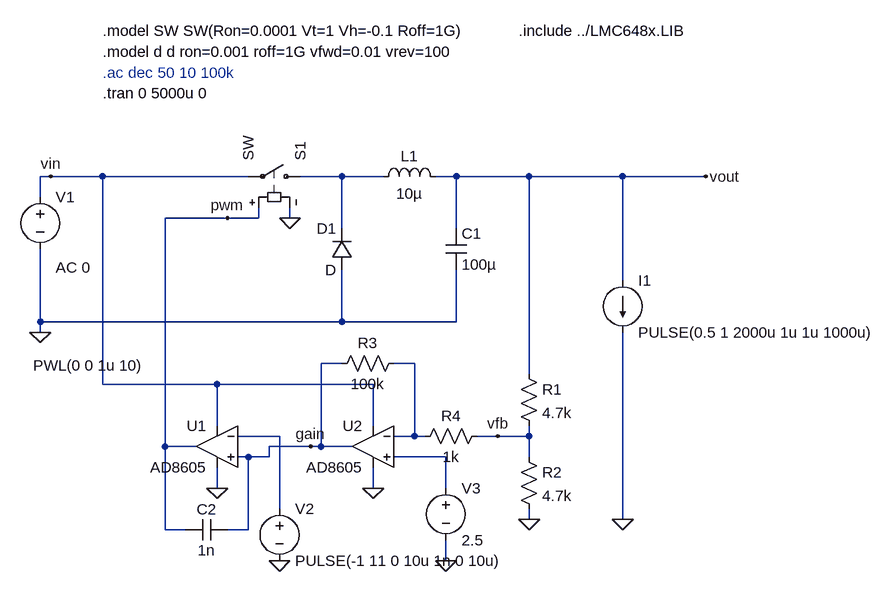
[diagram p0: schematic avg-ac-fb.asc]
avg-ac-fb.asc, the LTspice schematic file:
Version 4
SHEET 1 1492 740
WIRE -128 112 -144 112
WIRE -48 112 -128 112
WIRE 176 112 -48 112
WIRE 320 112 256 112
WIRE 384 112 320 112
WIRE 496 112 464 112
WIRE 608 112 496 112
WIRE 752 112 608 112
WIRE 880 112 752 112
WIRE -144 144 -144 112
WIRE 144 176 48 176
WIRE 192 176 192 160
WIRE 192 176 144 176
WIRE 240 176 240 160
WIRE 320 192 320 112
WIRE 496 192 496 112
WIRE 752 272 752 112
WIRE -144 336 -144 224
WIRE 320 336 320 256
WIRE 320 336 -144 336
WIRE 496 336 496 256
WIRE 496 336 320 336
WIRE -144 352 -144 336
WIRE 320 400 288 400
WIRE 432 400 400 400
WIRE 608 416 608 112
WIRE -48 432 -48 112
WIRE 128 432 -48 432
WIRE 368 432 128 432
WIRE 128 496 128 432
WIRE 368 496 368 432
WIRE 224 512 160 512
WIRE 432 512 432 400
WIRE 432 512 400 512
WIRE 448 512 432 512
WIRE 560 512 528 512
WIRE 608 512 608 496
WIRE 608 512 560 512
WIRE 48 528 48 176
WIRE 96 528 48 528
WIRE 272 528 208 528
WIRE 288 528 288 400
WIRE 288 528 272 528
WIRE 336 528 288 528
WIRE 176 544 160 544
WIRE 208 544 208 528
WIRE 208 544 176 544
WIRE 480 544 400 544
WIRE 608 544 608 512
WIRE 128 592 128 560
WIRE 368 592 368 560
WIRE 480 592 480 544
WIRE 224 624 224 512
WIRE 608 640 608 624
WIRE 752 640 752 352
WIRE 48 656 48 528
WIRE 80 656 48 656
WIRE 176 656 176 544
WIRE 176 656 144 656
WIRE 480 704 480 672
FLAG -144 352 0
FLAG 880 112 vout
FLAG -128 112 vin
FLAG 144 176 pwm
FLAG 608 640 0
FLAG 480 704 0
FLAG 368 592 0
FLAG 752 640 0
FLAG 128 592 0
FLAG 240 176 0
FLAG 224 704 0
FLAG 560 512 vfb
FLAG 272 528 gain
SYMBOL voltage -144 128 R0
WINDOW 123 24 124 Left 2
WINDOW 39 0 0 Left 0
WINDOW 3 -11 275 Left 2
SYMATTR Value2 AC 0
SYMATTR Value PWL(0 0 1u 10)
SYMATTR InstName V1
SYMBOL ind 368 128 R270
WINDOW 0 32 56 VTop 2
WINDOW 3 5 56 VBottom 2
SYMATTR InstName L1
SYMATTR Value 10µ
SYMBOL cap 480 192 R0
SYMATTR InstName C1
SYMATTR Value 100µ
SYMBOL res 592 400 R0
SYMATTR InstName R1
SYMATTR Value 4.7k
SYMBOL res 592 528 R0
SYMATTR InstName R2
SYMATTR Value 4.7k
SYMBOL voltage 480 576 R0
WINDOW 123 0 0 Left 0
WINDOW 39 0 0 Left 0
SYMATTR InstName V3
SYMATTR Value 2.5
SYMBOL current 752 272 R0
WINDOW 123 0 0 Left 0
WINDOW 39 0 0 Left 0
SYMATTR InstName I1
SYMATTR Value PULSE(0.5 1 2000u 1u 1u 1000u)
SYMBOL diode 336 256 R180
WINDOW 0 24 64 Left 2
WINDOW 3 24 0 Left 2
SYMATTR InstName D1
SYMBOL sw 272 112 M270
SYMATTR InstName S1
SYMBOL voltage 224 608 R0
WINDOW 123 0 0 Left 0
WINDOW 39 0 0 Left 0
SYMATTR InstName V2
SYMATTR Value PULSE(-1 11 0 10u 1n 0 10u)
SYMBOL OpAmps\\AD8605 128 464 M0
SYMATTR InstName U1
SYMBOL OpAmps\\AD8605 368 464 M0
SYMATTR InstName U2
SYMBOL res 416 384 R90
WINDOW 0 0 56 VBottom 2
WINDOW 3 32 56 VTop 2
SYMATTR InstName R3
SYMATTR Value 100k
SYMBOL res 544 496 R90
WINDOW 0 0 56 VBottom 2
WINDOW 3 32 56 VTop 2
SYMATTR InstName R4
SYMATTR Value 1k
SYMBOL cap 144 640 R90
WINDOW 0 0 32 VBottom 2
WINDOW 3 32 32 VTop 2
SYMATTR InstName C2
SYMATTR Value 1n
TEXT -48 -112 Left 2 !.model SW SW(Ron=0.0001 Vt=1 Vh=-0.1 Roff=1G)
TEXT -48 -80 Left 2 !.model d d ron=0.001 roff=1G vfwd=0.01 vrev=100
TEXT -48 -48 Left 2 ;.ac dec 50 10 100k
TEXT -48 -16 Left 2 !.tran 0 5000u 0
TEXT 592 -112 Left 2 !.include ../LMC648x.LIB

The netlist it stands for:
* avg-ac-fb.asc
V1 vin 0 PWL(0 0 1u 10) AC 0
L1 N001 vout 10µ
C1 vout 0 100µ
R1 vout vfb 4.7k
R2 vfb 0 4.7k
V3 N004 0 2.5
I1 vout 0 PULSE(0.5 1 2000u 1u 1u 1000u)
D1 0 N001 D
S1 N001 vin pwm 0 SW
V2 N003 0 PULSE(-1 11 0 10u 1n 0 10u)
XU1 gain N003 vin 0 pwm AD8605  ; pins In+ In- V+ V- OUT
XU2 N004 N002 vin 0 gain AD8605  ; pins In+ In- V+ V- OUT
R3 N002 gain 100k
R4 vfb N002 1k
C2 gain pwm 1n
.model D D
.lib standard.dio
.model SW SW(Ron=0.0001 Vt=1 Vh=-0.1 Roff=1G)
.model d d ron=0.001 roff=1G vfwd=0.01 vrev=100
* .ac dec 50 10 100k
.tran 0 5000u 0
.include ../LMC648x.LIB
.lib ADI.lib
.backanno
.end